# Altium schematic sheet Netscale48HD_RS4850.SchDoc: RS4850 Transceiver
size A3; Organization: Reichle & De-Massari; Address1: Binzstrasse 32; Address2: 8620 Wetzikon; Address3: Switzerland; DocumentNumber: 4; Revision: V0.2; SheetNumber: 4; SheetTotal: 5
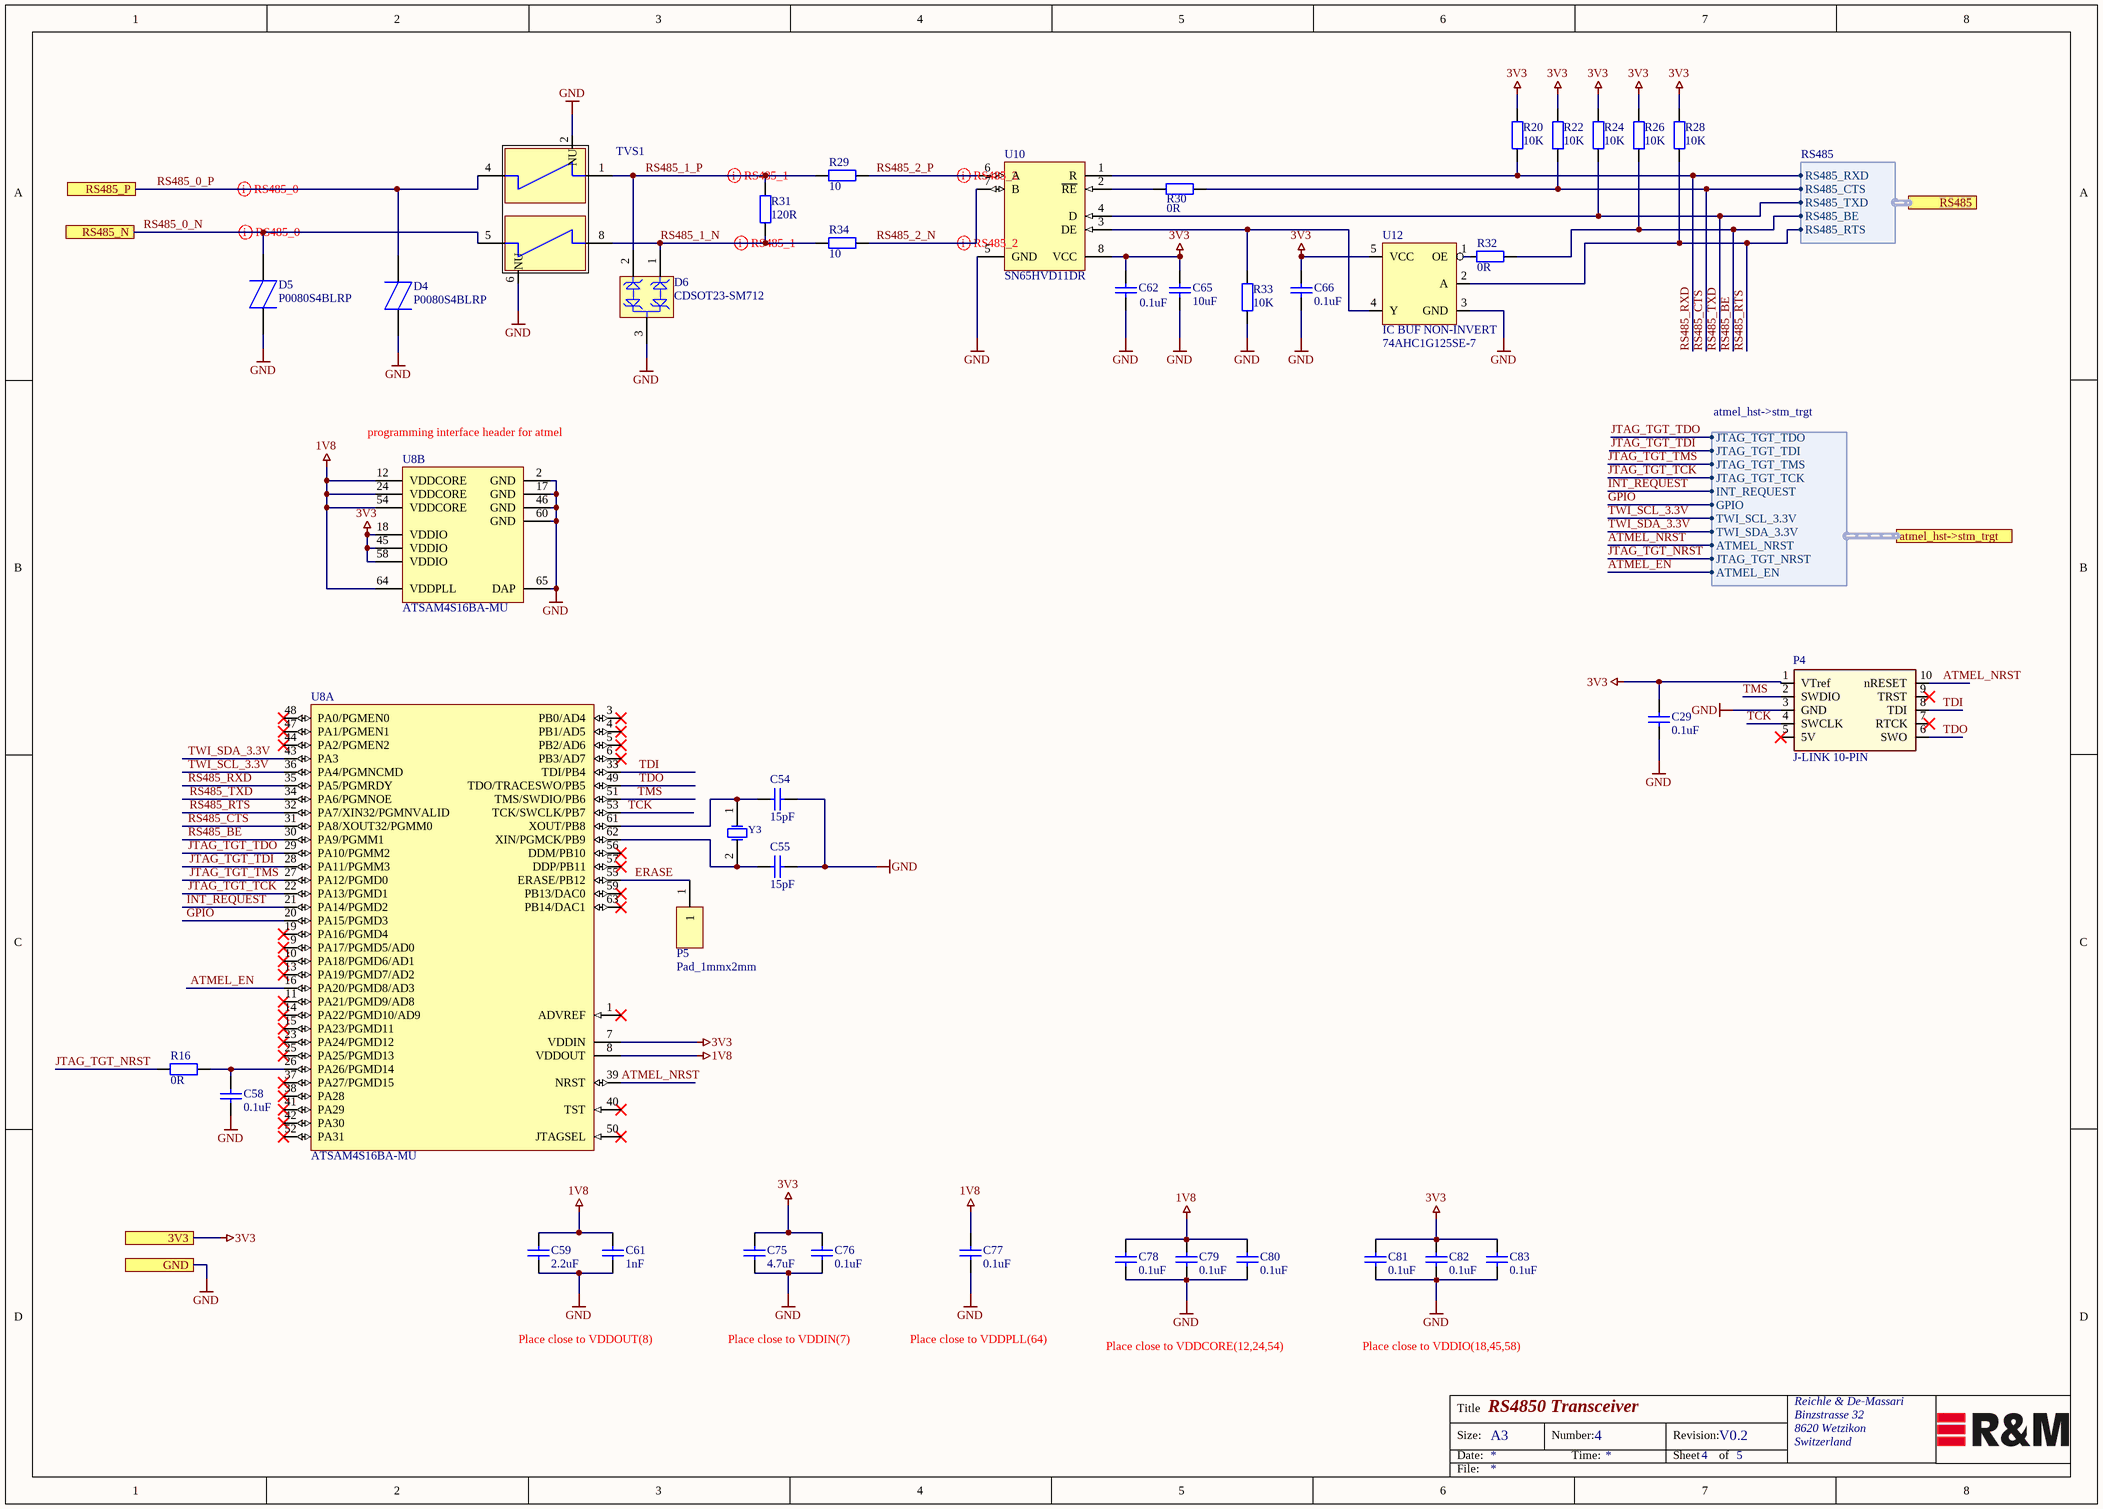
[diagram p0: Netscale48HD_RS4850.SchDoc]

## Parts
C29  0.1uF  [Ceramic Capacitor 0402 EIA]
C54  15pF  [Ceramic Capacitor 0402 EIA]
C55  15pF  [Ceramic Capacitor 0402 EIA]
C58  0.1uF  [Ceramic Capacitor 0402 EIA]
C59  2.2uF  [Ceramic Capacitor 0402 EIA]
C61  1nF  [Ceramic Capacitor 0402 EIA]
C62  0.1uF  [Ceramic Capacitor 0402 EIA]
C65  10uF  [Ceramic Capacitor 0402 EIA]
C66  0.1uF  [Ceramic Capacitor 0402 EIA]
C75  4.7uF  [Ceramic Capacitor 0603 EIA]
C76  0.1uF  [Ceramic Capacitor 0402 EIA]
C77  0.1uF  [Ceramic Capacitor 0402 EIA]
C78  0.1uF  [Ceramic Capacitor 0402 EIA]
C79  0.1uF  [Ceramic Capacitor 0402 EIA]
C80  0.1uF  [Ceramic Capacitor 0402 EIA]
C81  0.1uF  [Ceramic Capacitor 0402 EIA]
C82  0.1uF  [Ceramic Capacitor 0402 EIA]
C83  0.1uF  [Ceramic Capacitor 0402 EIA]
D4  P0080S4BLRP  [P0080S4BLRP]
D5  P0080S4BLRP  [P0080S4BLRP]
D6  CDSOT23-SM712  [BOUR-SOT23-3_V]
P4  J-LINK 10-PIN  [CONN-SEGGER-10-PIN]
P5  Pad_1mmx2mm  [Pad_1mmx2mm]
R16  0R  [Resistor 0402 EIA]
R20  10K  [Resistor 0402 EIA]
R22  10K  [Resistor 0402 EIA]
R24  10K  [Resistor 0402 EIA]
R26  10K  [Resistor 0402 EIA]
R28  10K  [Resistor 0402 EIA]
R29  10  [RES-0603[1608] - RFL]
R30  0R  [Resistor 0402 EIA]
R31  120R  [RES-0402[1005] - RFL]
R32  0R  [Resistor 0402 EIA]
R33  10K  [Resistor 0402 EIA]
R34  10  [RES-0603[1608] - RFL]
TVS1  TBU-CA065-200-WH  [Bourns_TBU_PL060_WH]  (value not drawn)
U8  ATSAM4S16BA-MU  [64PS_N]  (parts A,B of 2)
U10  SN65HVD11DR  [TI_D (R-PDSO-G8)_8_R]
U12  IC BUF NON-INVERT  [SOT353]
Y3  ABM3-12.000MHZ-B2-T  [ABM3-12.000MHZ-B2-T]  (value not drawn)

## Ports
3V3, atmel_hst->stm_trgt (harness atmel_hst->stm_trgt), GND, RS485 (harness RS485), RS485_N, RS485_P

## Harnesses
RS485: RS485_RXD, RS485_CTS, RS485_TXD, RS485_BE, RS485_RTS
atmel_hst->stm_trgt: JTAG_TGT_TDO, JTAG_TGT_TDI, JTAG_TGT_TMS, JTAG_TGT_NRST, INT_REQUEST, GPIO, TWI_SCL_3.3V, TWI_SDA_3.3V, ATMEL_EN, JTAG_TGT_TCK, ATMEL_NRST

## Nets
1V8: C59.2 C61.2 C77.2 C78.2 C79.2 C80.2 U8.8(VDDOUT) U8.12(VDDCORE) U8.24(VDDCORE) U8.54(VDDCORE) U8.64(VDDPLL)
3V3: C29.2 C62.1 C65.2 C66.1 C75.2 C76.2 C81.2 C82.2 C83.2 P4.1(VTref) R20.2 R22.2 R24.2 R26.2 R28.2 U8.7(VDDIN) U8.18(VDDIO) U8.45(VDDIO) U8.58(VDDIO) U10.8(VCC) U12.5(VCC) ; port 3V3
GND: C29.1 C54.1 C55.1 C58.1 C59.1 C61.1 C62.2 C65.1 C66.2 C75.1 C76.1 C77.1 C78.1 C79.1 C80.1 C81.1 C82.1 C83.1 D4.1(A) D5.1(A) D6.3 P4.3(GND) R33.1 TVS1.2(NU) TVS1.6(NU) U8.2(GND) U8.17(GND) U8.46(GND) U8.60(GND) U8.65(DAP) U10.5(GND) U12.3(GND) ; port GND
ATMEL_EN: U8.16(PA20/PGMD8/AD3) ; port atmel_hst->stm_trgt.ATMEL_EN
ATMEL_NRST: P4.10(nRESET) U8.39(NRST) ; port atmel_hst->stm_trgt.ATMEL_NRST
ERASE: P5.1 U8.55(ERASE/PB12)
GPIO: U8.20(PA15/PGMD3) ; port atmel_hst->stm_trgt.GPIO
INT_REQUEST: U8.21(PA14/PGMD2) ; port atmel_hst->stm_trgt.INT_REQUEST
JTAG_TGT_NRST: R16.1 ; port atmel_hst->stm_trgt.JTAG_TGT_NRST
JTAG_TGT_TCK: U8.22(PA13/PGMD1) ; port atmel_hst->stm_trgt.JTAG_TGT_TCK
JTAG_TGT_TDI: U8.28(PA11/PGMM3) ; port atmel_hst->stm_trgt.JTAG_TGT_TDI
JTAG_TGT_TDO: U8.29(PA10/PGMM2) ; port atmel_hst->stm_trgt.JTAG_TGT_TDO
JTAG_TGT_TMS: U8.27(PA12/PGMD0) ; port atmel_hst->stm_trgt.JTAG_TGT_TMS
RS485_0_N: D5.2(K) TVS1.5 ; port RS485_N
RS485_0_P: D4.2(K) TVS1.4 ; port RS485_P
RS485_1_N: D6.1 R31.2 R34.2 TVS1.8
RS485_1_P: D6.2 R29.2 R31.1 TVS1.1
RS485_2_N: R34.1 U10.7(B)
RS485_2_P: R29.1 U10.6(A)
RS485_BE: R26.1 R32.2 U8.30(PA9/PGMM1) ; port RS485.RS485_BE
RS485_CTS: R22.1 R30.2 U8.31(PA8/XOUT32/PGMM0) ; port RS485.RS485_CTS
RS485_RTS: R28.1 U8.32(PA7/XIN32/PGMNVALID) U12.2(A) ; port RS485.RS485_RTS
RS485_RXD: R20.1 U8.35(PA5/PGMRDY) U10.1(R) ; port RS485.RS485_RXD
RS485_TXD: R24.1 U8.34(PA6/PGMNOE) U10.4(D) ; port RS485.RS485_TXD
TCK: P4.4(SWCLK) U8.53(TCK/SWCLK/PB7)
TDI: P4.8(TDI) U8.33(TDI/PB4)
TDO: P4.6(SWO) U8.49(TDO/TRACESWO/PB5)
TMS: P4.2(SWDIO) U8.51(TMS/SWDIO/PB6)
TWI_SCL_3.3V: U8.36(PA4/PGMNCMD) ; port atmel_hst->stm_trgt.TWI_SCL_3.3V
TWI_SDA_3.3V: U8.43(PA3) ; port atmel_hst->stm_trgt.TWI_SDA_3.3V
NetC54_2: C54.2 U8.61(XOUT/PB8) Y3.1(OSC1)
NetC55_2: C55.2 U8.62(XIN/PGMCK/PB9) Y3.2(OSC2)
NetC58_2: C58.2 R16.2 U8.26(PA26/PGMD14)
NetR30_1: R30.1 U10.2(~{RE})
NetR32_1: R32.1 U12.1(OE)
NetR33_2: R33.2 U10.3(DE) U12.4(Y)

Not connected (* = marked no-connect by the designer): P4 5(5V)* 7(RTCK)* 9(TRST)*; U8 1(ADVREF)* 3(PB0/AD4)* 4(PB1/AD5)* 5(PB2/AD6)* 6(PB3/AD7)* 9(PA17/PGMD5/AD0)* 10(PA18/PGMD6/AD1)* 11(PA21/PGMD9/AD8)* 13(PA19/PGMD7/AD2)* 14(PA22/PGMD10/AD9)* 15(PA23/PGMD11)* 19(PA16/PGMD4)* 23(PA24/PGMD12)* 25(PA25/PGMD13)* 37(PA27/PGMD15)* 38(PA28)* 40(TST)* 41(PA29)* 42(PA30)* 44(PA2/PGMEN2)* 47(PA1/PGMEN1)* 48(PA0/PGMEN0)* 50(JTAGSEL)* 52(PA31)* 56(DDM/PB10)* 57(DDP/PB11)* 59(PB13/DAC0)* 63(PB14/DAC1)*

## Layout directives
differential pair: RS485_0_N, RS485_0_P, RS485_1_N, RS485_1_P, RS485_2_N, RS485_2_P

## Notes on the sheet
- (near U8) programming interface header for atmel
- Place close to VDDOUT(8)
- Place close to VDDIN(7)
- Place close to VDDPLL(64)
- Place close to VDDCORE(12,24,54)
- Place close to VDDIO(18,45,58)
- Title
- Size:
- Date:
- A3
- Number:
- Time:
- Revision:
- Sheet
- of
- File:

## Library data of the parts
C29 C58 C76-C83 = Cap_0.1uF_0402: SMD/SMT WCAP-CSGP 0.1uF 0402 20% 10V MLCC; Manufacturer: Wurth Electronics; Manufacturer PartNr: 885012105010; voltage: 10VDC; Replaceable: yes; Dielectric Grade: X5R; value: 0.1uF; tolerance: 20%; Footprint/Package: 0402; ComponentLink1Description: mouser; ComponentLink1URL: https://www.mouser.ch/ProductDetail/Wurth-Electronics/885012105010?qs=sGAEpiMZZMs0AnBnWHyRQEGbLOF2VP1ihL84oCjXnlO407YOHi%2fQbw%3d%3d; Supplier 1: Mouser; Supplier 2: Farnell; Supplier 3: Digi-Key; Supplier Part Number 1: 710-885012105010; Supplier Part Number 2: 2533928; Supplier Part Number 3: 732-7487-1-ND
C54 C55 = Cap_15pF_0402: Multilayer Ceramic Capacitors MLCC; Manufacturer: Muarata; Manufacturer PartNr: GJM1555C1H150FB01D; tolerance: ±1%; voltage: 50V; Replaceable: no; Dielectric Grade: NP0; value: 15pF; Footprint/Package: 0402; ComponentLink1Description: digikey; ComponentLink1URL: https://www.digikey.com/product-detail/en/murata-electronics-north-america/GJM1555C1H150FB01D/490-11191-6-ND/5333833
C59 = Cap_2.2uF_0402: 2.2µF ±20% 25V Ceramic Capacitor X5R 0402 (1005 Metric); Manufacturer: Murata; Manufacturer PartNr: GRM155R61E225ME15D; Replaceable: yes; value: 2.2uF; tolerance: ±20%; voltage: 25V; Dielectric Grade: X5R; Footprint/Package: 0402; ComponentLink1Description: digikey; ComponentLink1URL: https://www.digikey.com/product-detail/en/murata-electronics-north-america/GRM155R61E225ME15D/490-10457-2-ND/5027542
C61 = Cap_1nF_0402: 1000pF ±20% 50V Ceramic Capacitor X5R 0402 (1005 Metric); Manufacturer: TDK Corporation; Manufacturer PartNr: C1005X5R1H102M050BA; Replaceable: yes; value: 1nF; tolerance: ±20%; voltage: 50V; Dielectric Grade: X5R; Footprint/Package: 0402; ComponentLink1Description: digikey; ComponentLink1URL: https://www.digikey.com/product-detail/en/tdk-corporation/C1005X5R1H102M050BA/445-13843-6-ND/3959939
C62 C66 = Cap_0.1uF_0402: SMD/SMT WCAP-CSGP 0.1uF 0402 20% 10V MLCC; Manufacturer: Wurth Electronics; Manufacturer PartNr: 885012105010; voltage: 10VDC; Dielectric Grade: X5R; Replaceable: yes; value: 0.1uF; tolerance: 20%; ComponentLink1Description: mouser; ComponentLink1URL: https://www.mouser.ch/ProductDetail/Wurth-Electronics/885012105010?qs=sGAEpiMZZMs0AnBnWHyRQEGbLOF2VP1ihL84oCjXnlO407YOHi%2fQbw%3d%3d; Footprint/Package: 0402; Supplier 1: Mouser; Supplier 2: Farnell; Supplier 3: Digi-Key; Supplier Part Number 1: 710-885012105010; Supplier Part Number 2: 2533928; Supplier Part Number 3: 732-7487-1-ND
C65 = Cap_10uF_0402: Multilayer Ceramic Capacitors MLCC - SMD/SMT; Manufacturer: Murata; Manufacturer PartNr: ZRB15XR61A106ME01D; tolerance: 20%; voltage: 10VDC; Replaceable: yes; Dielectric Grade: X5R; value: 10uF; ComponentLink1Description: mouser; ComponentLink1URL: https://www.mouser.ch/ProductDetail/Murata-Electronics/ZRB15XR61A106ME01D?qs=sGAEpiMZZMs0AnBnWHyRQN7%2fAA2D2lPPC0%2fdyv23S%2fU%252bBeuYI5b1UA%3d%3d; Footprint/Package: 0402; Supplier 1: Mouser; Supplier Part Number 1: 81-ZRB15XR61A106ME1D
C75 = Cap_4.7uF_0603: SMD/SMT 0603 4.7uF 10volts; Manufracturer: Murata; Manufacturer PartNr: GRM188R61A475KE15D; tolerance: 20%; voltage: 10VDC; Replaceable: yes; Dielectric Grade: X5R; value: 4.7uF; Footprint/Package: 0603
D4 D5 = P0080S4BLRP: Thyristor Surge Protection Devices (TSPD) PxxxxS4xLRP Series SIDACtor Protection Thyristor 100A 25V Bi SOD; Manufacturer: Littelfuse; Replaceable: no; ComponentLink1Description: mouser; ComponentLink1URL: https://www.mouser.ch/ProductDetail/Diodes-Incorporated/DESD3V3S1BL-7B?qs=%2fha2pyFaduhA707awRoRgtNXj1BWecNQPXz8CtVYm9O48rqwfwJI0g%3d%3d; Footprint/Package: SOD-123FL; Supplier 1: Mouser; Supplier Part Number 1: 576-P0080S4BLRP; Supplier 2: Digikey; Supplier Part Number 2: P0080S4BLRPCT-ND; Manufacturer PartNr: P0080S4BLRP
D6 = Surface Mount TVS Diode: Surface Mount TVS Diode, 17 A Ipp, -55 to 150 degC, 3-Pin SOT23, RoHS, Tape and Reel; Manufacturer: Bourns; Catalog Drawings: CDSOT23-SM712Schematic; Current - Peak Pulse (10/1000µs): 17A(8/20µs); Voltage - Breakdown (Min): 7.5V,13.3V; Online Catalog: CDSOT23Series; Power Line Protection: No; Bidirectional Channels: 2; Type: Zener; For Use With: EVAL-CN0313-SDPZ-ND-EVALEMCRS-485CERTIFIED; Kits: PN-DESIGNKIT-22-ND-KITESD/EFTSURGEPROTECTION; Capacitance @ Frequency: 75pF@1MHz; Product Training Modules: ESDProtectionProducts; Voltage - Clamping (Max) @ Ipp: 14V,26V; Voltage - Reverse Standoff (Typ): 7V(Max),12V(Max); Related Products: ADM3485EARZ-REEL7TR-ND-ICTXRXRS-485HS3.3V8SOICADM3485EARZ-REEL7CT-ND-ICTXRXRS-485HS3.3V8SOICADM3485EARZ-REEL7DKR-ND-ICTXRXRS-485HS3.3V8SOICADM3485EARZ-ND-ICTX/RXRS-485HS3.3V8-SOICADM3485EAR-ND-ICTX/RXRS-485HS3.3V8-SOIC296-38503-5-ND-ICTXRXRS4853.3VESD14SOIC296-38501-5-ND-ICRS485TXRX3.3ESD8SOIC296-38522-5-ND-ICTXRXRS4853.3V14SOIC296-38502-5-ND-ICTXRXRS4853.3VESD14SOICADM3485EARZ-REELTR-ND-ICTXRXRS-4853.3V8SOICADM3485EARZ-REELCT-ND-ICTXRXRS-4853.3V8SOICADM3485EARZ-REELDKR-ND-ICTXRXRS-4853.3V8SOIC296-40517-2-ND-ICTXRXRS4853.3V14SOIC296-40517-1-ND-ICTXRXRS4853.3V14SOIC296-40517-6-ND-ICTXRXRS4853.3V14SOIC296-40519-2-ND-ICRS485TXRX3.3ESD8SOIC296-40519-1-ND-ICRS485TXRX3.3ESD8SOIC296-40519-6-ND-ICRS485TXRX3.3ESD8SOIC296-40524-2-ND-ICTXRXRS4853.3VESD8SOIC296-40524-1-ND-ICTXRXRS4853.3VESD8SOIC296-40524-6-ND-ICTXRXRS4853.3VESD8SOIC296-40522-2-ND-ICTXRXRS4853.3VESD14SOIC296-40522-1-ND-ICTXRXRS4853.3VESD14SOIC296-40522-6-ND-ICTXRXRS4853.3VESD14SOIC296-40529-2-ND-ICRS485TXRX3.3ESD8SOIC296-40529-1-ND-ICRS485TXRX3.3ESD8SOIC2; Other Names: CDSOT23-SM712CT; Power - Peak Pulse: 400W; Replaceable: no; Applications: GeneralPurpose; Supplier Device Package: SOT-23-3; Package / Case: TO-236-3,SC-59,SOT-23-3; Mounting Type: SurfaceMount; Datasheet URL: https://datasheet.ciiva.com/11193/cdsot23-sm712-11193846.pdf; Standard Package: 1; Series: -; Category: CircuitProtection; Unidirectional Channels: -; Package Description: 3-Lead Small Out-Line Transistor, Body 2.9x1.3mm, Pitch 0.95mm; Family: TVS-Diodes; Datasheet Version: Aug-12; Manufacturer URL: http://www.bourns.com/; Operating Temperature: -55degC~150degC(TJ); Packaging: CutTape(CT); value: CDSOT23-SM712; Footprint/Package: DO-214AC-2 (SMA)
P4 = CONN_Segger_10_PIN: Segger, J-Link 10-pin Needle Adapter
R16 = Res_0R_0402: 0 Ohms Resistor 0402; Manufacturer: Panasonic Electronic Components; Manufacturer PartNr: ERJ-2GE0R00X; power: 100mW; Replaceable: yes; value: 0R; tolerance: -; Footprint/Package: 0402 (1005 metric); Supplier 1: Digi-Key; Supplier Part Number 1: P0.0JCT-ND
R20 R22 R24 R26 R28 R33 = Res_10K_0402: SMD 10K ohm 1% 50V General Purpose; Manufacturer: Yageo; Manufacturer PartNr: RC0402FR-1010KL; power: 63mW; Replaceable: yes; value: 10K; tolerance: 1%; ComponentLink1Description: mouser; ComponentLink1URL: https://www.mouser.ch/ProductDetail/Yageo/RC0402FR-1010KL?qs=sGAEpiMZZMtlubZbdhIBIEgN9MQql2m6Sb2LnYlCICU%3d; Footprint/Package: 0402; Supplier 1: Mouser; Supplier Part Number 1: 603-RC0402FR-1010KL
R29 R34 = Res_10R_0603(1608): Thick Film Resistors - SMD 1/4watt 10ohms 1% High Power AEC-Q200; Manufacturer: Vishay; Manufacturer PartNr: CRCW060310R0FKEAHP; Replaceable: yes; voltage: 75 V; power: 250 mW (1/4 W); value: 10; Supplier 1: Mouser; Supplier Part Number 1: 71-CRCW060310R0FKEAH; Footprint/Package: 0603; tolerance: 1 %
R30 R32 = Res_0R_0402: 0 Ohms Jumper 0.1W, 1/10W Chip Resistor 0402 (1005 Metric) Automotive AEC-Q200 Thick Film; Manufacturer: Panasonic Electronic Components; Manufacturer PartNr: ERJ-2GE0R00X; power: 100mW; Replaceable: yes; value: 0R; tolerance: -; Footprint/Package: 0402
R31 = PassResBas0402-00405-A.3: 120 Ohms ±1% 0.063W, 1/16W Chip Resistor 0402 (1005 Metric) Automotive AEC-Q200, Moisture Resistant Thick Film; Manufacturer PartNr: CRGCQ0402F120R; Manufacturer: TE Connectivity; value: 120R; tolerance: 1%; Supplier 1: Digi-Key; Supplier Part Number 1: A129616CT-ND; power: 0.063W
TVS1 = Bourns_TBU-PL060-200-WH: TBU-PL Series dual 50 ohm Surge Suppressors, bi-directional; Manufacturer: Bourns; Replaceable: no; Manufacturer PartNr: TBU-PL060-200-WH; Supplier 1: Mouser; Footprint/Package: DFN; Supplier Part Number 1: 652-TBU-PL060-200-WH; value: TBU-PL060-200-WH
U8 = ATSAM4S16BA-MU: AT91 ARM Cortex-M4 32-bit Microcontroller, 1MB Flash, 128KB SRAM, USB, 79 User I/Os, 64-Pin QFN, Industrial Grade (-40°C to 105°C), Pb-Free; Manufacturer: Atmel; Replaceable: no; DatasheetVersion: revA, Oct-2011; PackageVersion: revJ, Jul-2007; PackageReference: 64PS; PackageDescription: 64-Pin Quad Flat No-Lead (QFN) Sawn, 9 x 9 x 1.0 mm Body, 0.5 mm Pitch, Exposed Pad; Code_JEDEC: MO-220VMMD-3; ComponentLink1Description: Manufacturer URL; ComponentLink1URL: http://www.atmel.com/; ComponentLink2Description: SAM4S Series Datasheet; ComponentLink2URL: http://www.atmel.com/dyn/resources/prod_documents/11100.pdf; ComponentLink3Description: SAM4S Series Summary; ComponentLink3URL: http://www.atmel.com/dyn/resources/prod_documents/11100S.pdf; Manufacturer PartNr: ATSAM4S16BA-MU; Footprint/Package: QFN, 64-Leads, Body 9x9mm, Pitch 0.5mm, Thermal Pad 7.5x7.5mm, IPC Medium Density
U10 = RS_485 Transceivers: 1/1 Transceiver Half RS422, RS485 8-SOIC; Manufacturer: TI; Replaceable: no; Manufacturer PartNr: SN65HVD11DR; ShortDescription: SN65HVD11DR; Supplier 1: Digi-Key; Supplier Part Number 1: 296-31717-1-ND; Footprint/Package: 8-SOIC
U12 = 74AHC1G125SE-7: Buffer, Non-Inverting 1 Element 1 Bit per Element 3-State Output SOT-353; Manufacturer: Diodes Incorporated; Replaceable: no; Footprint/Package: SOT353; ComponentLink1Description: mouser; ComponentLink1URL: https://www.mouser.ch/ProductDetail/Samtec/BBL-103-G-E?qs=sGAEpiMZZMs%252bGHln7q6pm5ZHNJhTjtr3eyJKd0ZImQM%3d; Supplier 2: Mouser; Supplier 1: Digi-Key; Supplier 3: Farnell; Supplier Part Number 1: SAM1104-03-ND; Supplier Part Number 2: 200-SL103G12; Supplier Part Number 3: 2019491; Manufacturer PartNr: 74AHC1G125SE-7
Y3 = CRYSTAL_2Pin_ABM3-12.000MHZ-B2-T: 12MHz ±20ppm Crystal 18pF 60 Ohms 2-SMD, No Lead; Manufacturer: Abracon LLC; Replaceable: no; Manufacturer PartNr: ABM3-12.000MHZ-B2-T; ShortDescription: 12MHz; Footprint/Package: 2-SMD; ComponentLink1Description: digikey; ComponentLink1URL: https://www.digikey.com/product-detail/en/abracon-llc/ABM3-12.000MHZ-B2-T/535-9100-2-ND/675295
P5 = Pad_1mmx2mm: Manufacturer: Pad_1mmx2mm; Manufacturer PartNr: Pad_1mmx2mm